# Altium schematic sheet Flash.SchDoc: Sample Sheet Title
size B; Date: MM/DD/YYYY; Author: Sample Author; Organization: ORGANIZATION; Address1: ADDRESS 1; Address2: ADDRESS 2; Address3: ADDRESS 3; Address4: ADDRESS 4; Revision: -; SheetNumber: 1; SheetTotal: 1; ENG_APP_DATE: --/--/--; DSN_APP_DATE: --/--/--; CHK_APP_DATE: --/--/--
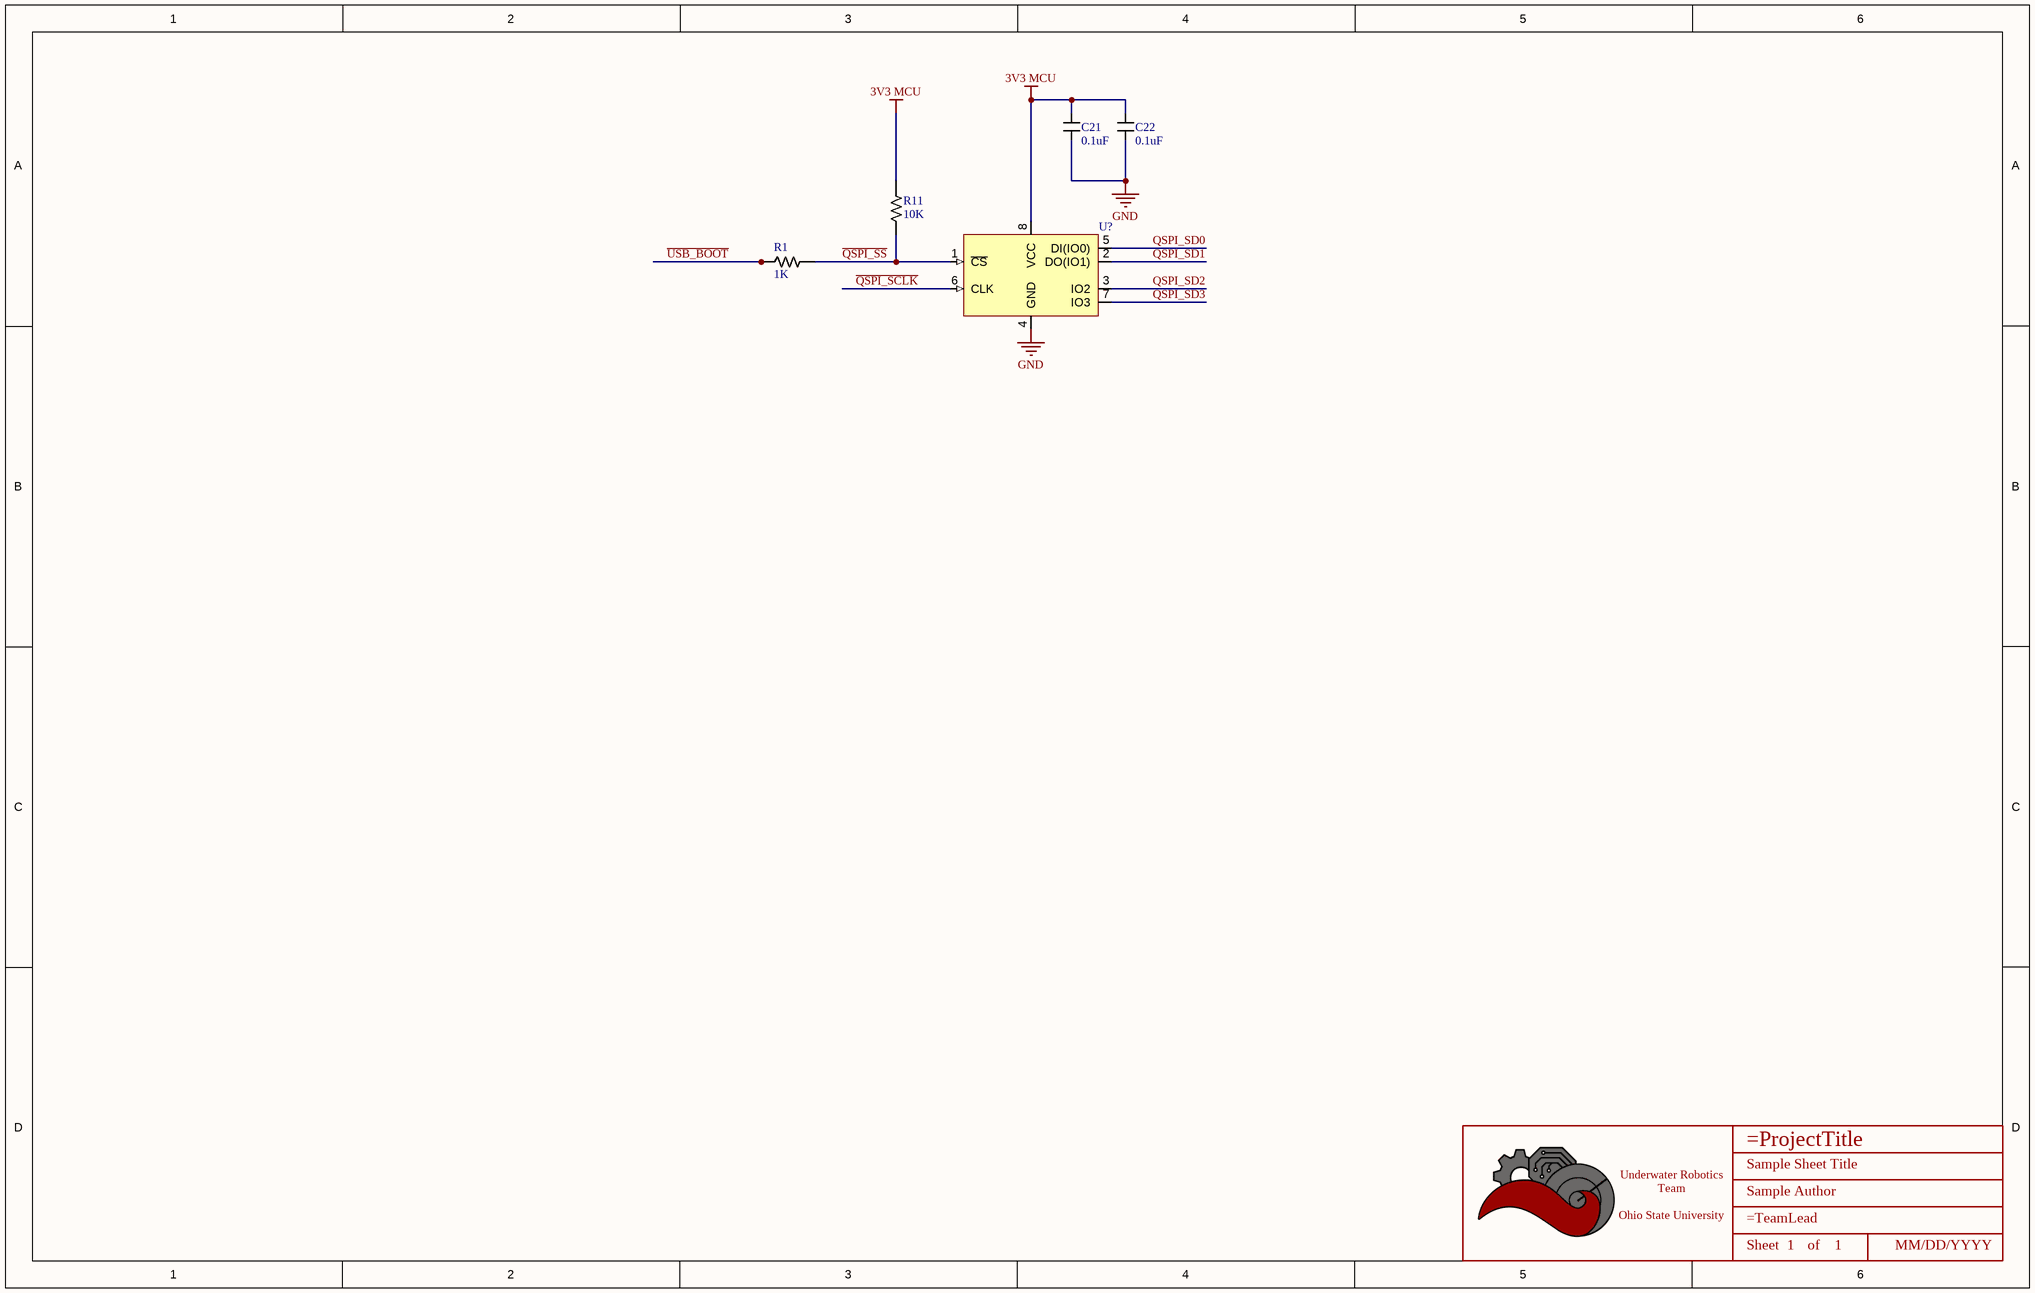
[diagram p0: Flash.SchDoc]

## Parts
*  Title_Block  [LOGO]  (value not drawn)  (graphical)
C21  value 0.1uF  [CAPACITOR_0402]  (hidden comment: 100nF Ceramic 25V)
C22  value 0.1uF  [CAPACITOR_0402]  (hidden comment: 100nF Ceramic 25V)
R1  Value  (Ohms): 1K  [RESISTOR_0603]  (hidden comment: 1k Ohm 5% 1/10W)
R11  Value  (Ohms): 10K  [RESISTOR_0603]  (hidden comment: 10k Ohm 0.5% 1/10W)
U?  W25Q128JVSIQ  [SOIC-8 W25QxJV]  (value not drawn)

## Nets
3V3 MCU: C21.1 C22.1 R11.1 U?.8(VCC)
GND: C21.2 C22.2 U?.4(GND)
\: R1.1 R11.2 U?.1(~{CS})  [also labelled ~{QSPI_SS}]
~{QSPI_SCLK}: U?.6(CLK)
~{USB_BOOT}: R1.2
QSPI_SD0: U?.5(DI(IO0))
QSPI_SD1: U?.2(DO(IO1))
QSPI_SD2: U?.3(IO2)
QSPI_SD3: U?.7(IO3)

## Notes on the sheet
- DWG. NO.
- REV.
- SHT.
- THIS DOCUMENT AND THE DATA DISCLOSED HEREIN OR HEREWITH IS THE PROPERTY OF ALTIUM LIMITED AND MAY BE FREELY DISTRIBUTED IN WHOLE. NO RIGHTS ARE RESERVED OR EXPRESS OR IMPLIED WARANTEE GIVEN.
- REVISION
- DESCRIPTION
- DATE
- APPROVED
- ENG:
- APPROVALS
- PROJECT
- DSN:
- CHK:
- REFERENCE DOCUMENTS
- PROJECT REVISION:
- TITLE
- DOCUMENT REVISION:
- DESIGN ITEM:
- BOM:
- FAB DWG:
- PCB DWG:
- ASSY DWG:
- SCALE:
- SIZE
- B
- CAGE CODE
- FILE NAME
- DWG NO.
- SHEET
- OF
- REV
- (in symbol Title_Block) Underwater Robotics Team / Ohio State University; Sheet; of

## Library data of the parts
* = Title_Block: UWRT Schematic Title Block Template / Created June 2021, Dylan Trainor
C21 C22 = CAPACITOR_0.1uF_0402: Cap 100nF 25V +/-10% / Ceramic 0402; Made By: Robert Pafford; Tolerance: +/- 10%; Voltage: 25V; Supplier 1: Future Electronics; Supplier Part Number 1: 7029569
R1 = RESISTOR_1K_0.5%_0603: RES 1k OHM 0.5% 1/10W 0603; Tolerance: +/- 0.5%; Made By: Robert Pafford; Wattage: 1/10W; Supplier: Digikey; Digikey Part Numer: CR0603-JW-104ELFTR-ND; Supplier 1: Digi-Key; Supplier Part Number 1: 749-1693-1-ND
R11 = RESISTOR_10K_0.5%_0603: RES 10k OHM 0.5% 1/10W 0603; Tolerance: +/- 0.5%; Made By: Robert Pafford; Wattage: 1/10W; Supplier: Digikey; Digikey Part Numer: CR0603-JW-104ELFTR-ND; Supplier 1: Digi-Key; Supplier Part Number 1: 749-1695-1-ND
U? = W25Q128JVSIQ: IC FLASH 128MBIT SPI/QUAD 8SOIC; Made By: Robert Pafford; Supplier 1: Digi-Key; Supplier Part Number 1: W25Q128JVSIQ-ND; Size: 128M